# Altium schematic sheet rf.SchDoc
size A4; SheetNumber: 2; SheetTotal: 5; SPICEModelCacheDZKFQWXO: <root> / <DocumentId>DZKFQWXO</DocumentId> / <CacheFrame Number="0"> / <Model Name="gmk107b7474_aht" Kind="CKT"> / <Text>* GMK107B7474_AHT     SPICE MODEL  ( General Type ) / *-------------------------------------------------------------------------------------------------------- / * Model Generated by TAIYO YUDEN Corporation (http://www.ty-top.com) / * Version 1.0 / * TAIYO YUDEN Control No. 170508_121019 / * Copyright(c) 2012 TAIYO YUDEN CO.,LTD. All Rights Reserved. / *-------------------------------------------------------------------------------------------------------- / * / * Products Name : Multilayer Ceramic Capacitors / * / * Characteristics : / *     Capacitance : 0.47 uF , Rated Voltage : 35V , TCC : X7R / *     Case Size : 1.6 x 0.8 / 0.063 x 0.031 [mm/inch] , Thickness : 0.8 / 0.031 [mm/inch] / *     (Conditions: Temperature = 25 degC , DC Bias Current/Voltage = 0A / 0V) / * / * Frequency Range : 40Hz - 3GHz / * / * External Node Assignments : / * / *  1  o---| |---o  2 / * / *-------------------------------------------------------------------------------------------------------- / .SubCkt GMK107B7474_AHT 1 2 / **************************** / C0 1 110 0.35241u / Cm 1 101 0.045967u / C1 101 102 0.1128u / Rc1 101 102 7.0157k / C2 102 103 0.052259u / Rc2 102 103 650.62 / C3 103 110 0.038908u / Rc3 103 110 33.924 / C2m 1 301 0.059177u / C21 301 302 0.20596u / Rc21 301 302 18.494k / C22 302 303 0.3392u / Rc22 302 303 11.168k / C23 303 304 0.29488u / Rc23 303 304 12.333k / C24 304 305 0.15174u / Rc24 304 305 1.1874k / C25 305 306 0.15169u / Rc25 305 306 1.0968k / C26 306 307 0.081575u / Rc26 306 307 73.58 / C27 307 308 0.067021u / Rc27 307 308 74.754 / C28 308 309 0.057362u / Rc28 308 309 86.716 / C29 309 110 3917.4p / Rc29 309 110 14.273 / Rp0 1 110 1.06382978723404G / L0 110 120 0.25665n / Lm 120 130 0.18492n / L1 120 121 0.15921n / RL1 121 130 0.10518 / L2 120 122 1.1975n / RL2 122 130 0.76936 / L3 120 123 2.5752n / RL3 123 130 1.6537 / CR 120 124 0.034572u / LR 124 125 0.3441n / RR 125 130 93.45m / CL 130 140 1.8662p / LL 130 140 0.25845n / RL 130 140 37.948 / Rs 140 2 10.204m / **************************** / .ends GMK107B7474_AHT</Text> / </Model> / </CacheFrame> / </root>
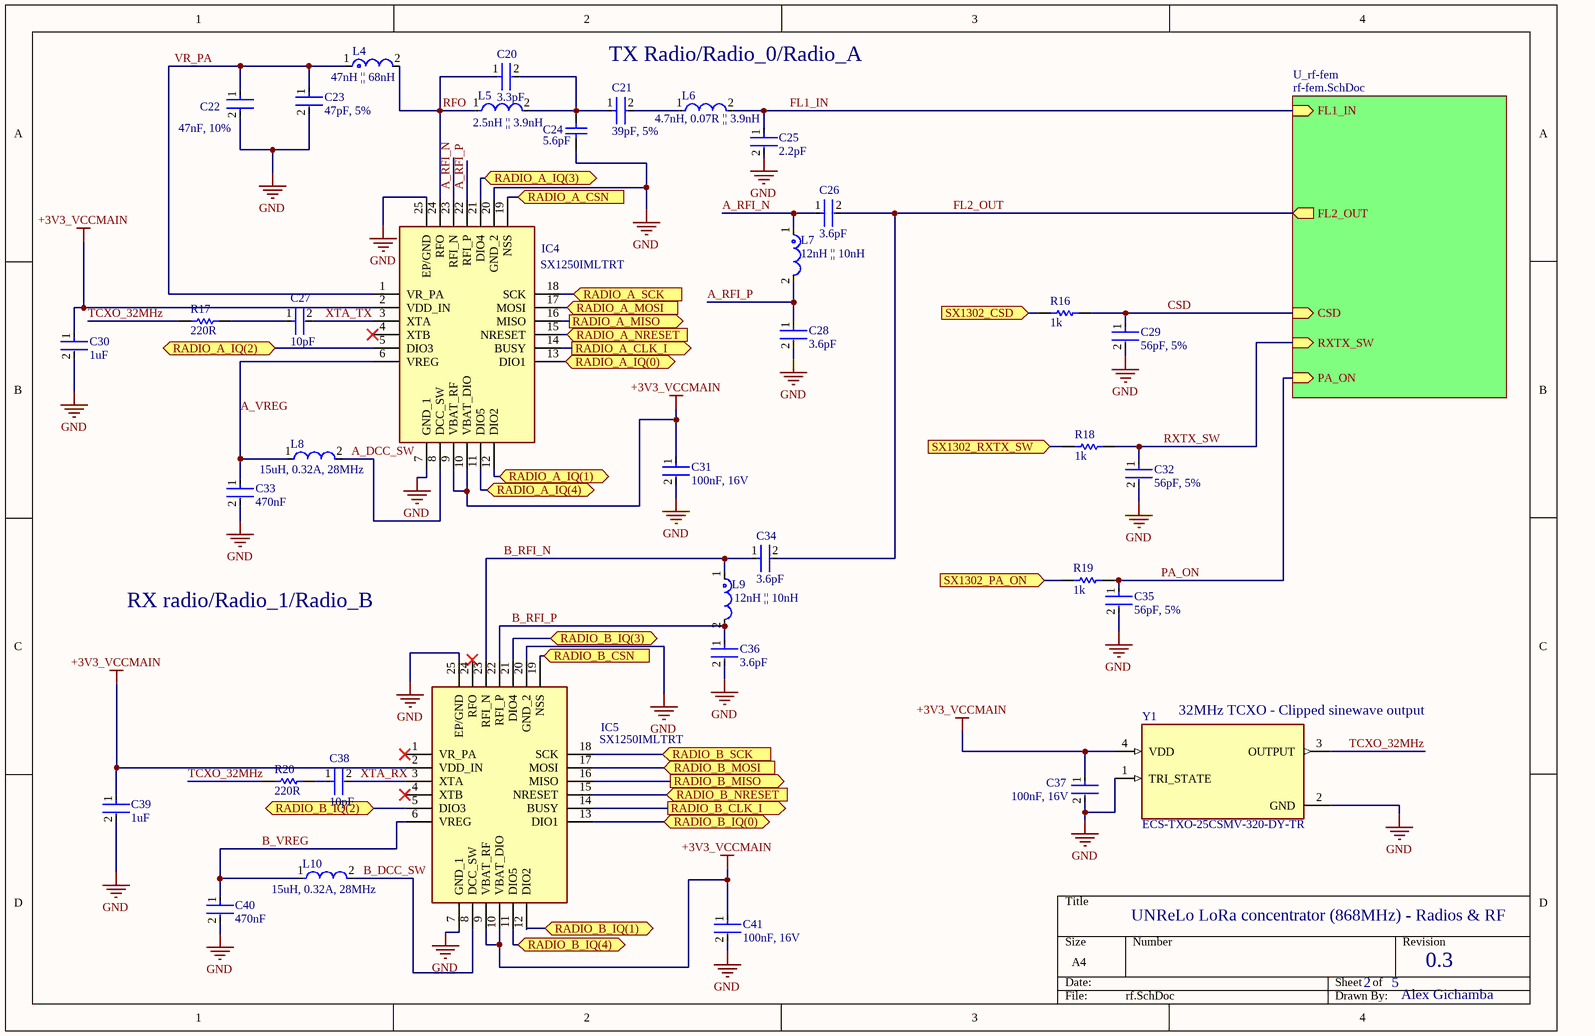
[diagram p0: rf.SchDoc]

## Parts
C20  3.3pF  [FP-GQM187-0_15-MFG]
C21  39pF, 5%  [FP-CL10-IPC_B]
C22  47nF, 10%  [FP-CL10-IPC_A]
C23  47pF, 5%  [FP-0603-L_1_6_0_15-W_0_81-MFG]
C24  5.6pF  [CAPC1608X90X35ML10T15]
C25  2.2pF  [FP-CL764-IPC_C]
C26  3.6pF  [FP-GJM155-0_05-IPC_C]
C27  10pF  [FP-CL10-IPC_A]
C28  3.6pF  [FP-GJM155-0_05-IPC_C]
C29  56pF, 5%  [FP-GCM188-0_1-IPC_A]
C30  1uF  [FP-CL21-IPC_A]
C31  100nF, 16V  [FP-CC0603-DA-MFG]
C32  56pF, 5%  [FP-GCM188-0_1-IPC_A]
C33  470nF  [FP-0603-L_1_6_0_1-W_0_8_0-IPC_A]
C34  3.6pF  [FP-GJM155-0_05-IPC_C]
C35  56pF, 5%  [FP-GCM188-0_1-IPC_A]
C36  3.6pF  [FP-GJM155-0_05-IPC_C]
C37  100nF, 16V  [FP-CC0603-DA-MFG]
C38  10pF  [FP-CL10-IPC_A]
C39  1uF  [FP-CL21-IPC_A]
C40  470nF  [FP-0603-L_1_6_0_1-W_0_8_0-IPC_A]
C41  100nF, 16V  [FP-CC0603-DA-MFG]
IC4  SX1250IMLTRT  [QFN50P400X400X100-25N-D]
IC5  SX1250IMLTRT  [QFN50P400X400X100-25N-D]
L4  47nH || 68nH  [FP-LQG18HH_00-MFG]
L5  2.5nH || 3.9nH  [FP-LQW15AN_00-W0_6-0_1-MFG]
L6  4.7nH, 0.07R || 3.9nH  [FP-LQW15AN_00-W0_6-0_1-MFG]
L7  12nH || 10nH  [FP-LQG15HH_02-IPC_A]
L8  15uH, 0.32A, 28MHz  [FP-CB2012-MFG]
L9  12nH || 10nH  [FP-LQG15HH_02-IPC_A]
L10  15uH, 0.32A, 28MHz  [FP-CB2012-MFG]
R16  1k  [RESC2013X70X40ML20T20]
R17  220R  [RESC1608X55X30LL15T15]
R18  1k  [RESC2013X70X40ML20T20]
R19  1k  [RESC2013X70X40ML20T20]
R20  220R  [RESC1608X55X30LL15T15]
Y1  ECS-TXO-25CSMV-320-DY-TR  [OSC_ECS-TXO-25CSMV-320-DY-TR]

## Sub-sheets
U_rf-fem = rf-fem.SchDoc: CSD (in), PA_ON (in), RXTX_SW (in), FL1_IN (in), FL2_OUT (out)

## Ports
RADIO_A_CLK_I (out), RADIO_A_CSN (in), RADIO_A_IQ(0) (bidir), RADIO_A_IQ(1) (bidir), RADIO_A_IQ(2) (bidir), RADIO_A_IQ(3) (bidir), RADIO_A_IQ(4) (bidir), RADIO_A_MISO (out), RADIO_A_MOSI (in), RADIO_A_NRESET (in), RADIO_A_SCK (in), RADIO_B_CLK_I (out), RADIO_B_CSN (in), RADIO_B_IQ(0) (bidir), RADIO_B_IQ(1) (bidir), RADIO_B_IQ(2) (bidir), RADIO_B_IQ(3) (bidir), RADIO_B_IQ(4) (bidir), RADIO_B_MISO (out), RADIO_B_MOSI (in), RADIO_B_NRESET (in), RADIO_B_SCK (in), SX1302_CSD (in), SX1302_PA_ON (in), SX1302_RXTX_SW (in)

## Nets
+3V3_VCCMAIN: C30.1 C31.1 C37.1 C39.1 C41.1 IC4.2(VDD_IN) IC4.9(VBAT_RF) IC4.10(VBAT_DIO) IC5.2(VDD_IN) IC5.9(VBAT_RF) IC5.10(VBAT_DIO) Y1.4(VDD)
GND: C22.2 C23.2 C24.1 C25.2 C28.2 C29.2 C30.2 C31.2 C32.2 C33.2 C35.2 C36.2 C37.2 C39.2 C40.2 C41.2 IC4.7(GND_1) IC4.20(GND_2) IC4.25(EP/GND) IC5.7(GND_1) IC5.20(GND_2) IC5.25(EP/GND) Y1.1(TRI_STATE) Y1.2(GND)
A_DCC_SW: IC4.8(DCC_SW) L8.2
A_RFI_N: C26.1 IC4.23(RFI_N) L7.1
A_RFI_P: C28.1 IC4.22(RFI_P) L7.2
A_VREG: C33.1 IC4.6(VREG) L8.1
B_DCC_SW: IC5.8(DCC_SW) L10.2
B_RFI_N: C34.1 IC5.23(RFI_N) L9.1
B_RFI_P: C36.1 IC5.22(RFI_P) L9.2
B_VREG: C40.1 IC5.6(VREG) L10.1
CSD: C29.1 R16.2 ; sheet U_rf-fem/CSD
FL1_IN: C25.1 L6.2 ; sheet U_rf-fem/FL1_IN
FL2_OUT: C26.2 C34.2 ; sheet U_rf-fem/FL2_OUT
PA_ON: C35.1 R19.2 ; sheet U_rf-fem/PA_ON
RADIO_A_CLK_I: IC4.14(BUSY) ; port RADIO_A_CLK_I
RADIO_A_CSN: IC4.19(NSS) ; port RADIO_A_CSN
RADIO_A_IQ(0): IC4.13(DIO1) ; port RADIO_A_IQ(0)
RADIO_A_IQ(1): IC4.12(DIO2) ; port RADIO_A_IQ(1)
RADIO_A_IQ(2): IC4.5(DIO3) ; port RADIO_A_IQ(2)
RADIO_A_IQ(3): IC4.21(DIO4) ; port RADIO_A_IQ(3)
RADIO_A_IQ(4): IC4.11(DIO5) ; port RADIO_A_IQ(4)
RADIO_A_MISO: IC4.16(MISO) ; port RADIO_A_MISO
RADIO_A_MOSI: IC4.17(MOSI) ; port RADIO_A_MOSI
RADIO_A_NRESET: IC4.15(NRESET) ; port RADIO_A_NRESET
RADIO_A_SCK: IC4.18(SCK) ; port RADIO_A_SCK
RADIO_B_CLK_I: IC5.14(BUSY) ; port RADIO_B_CLK_I
RADIO_B_CSN: IC5.19(NSS) ; port RADIO_B_CSN
RADIO_B_IQ(0): IC5.13(DIO1) ; port RADIO_B_IQ(0)
RADIO_B_IQ(1): IC5.12(DIO2) ; port RADIO_B_IQ(1)
RADIO_B_IQ(2): IC5.5(DIO3) ; port RADIO_B_IQ(2)
RADIO_B_IQ(3): IC5.21(DIO4) ; port RADIO_B_IQ(3)
RADIO_B_IQ(4): IC5.11(DIO5) ; port RADIO_B_IQ(4)
RADIO_B_MISO: IC5.16(MISO) ; port RADIO_B_MISO
RADIO_B_MOSI: IC5.17(MOSI) ; port RADIO_B_MOSI
RADIO_B_NRESET: IC5.15(NRESET) ; port RADIO_B_NRESET
RADIO_B_SCK: IC5.18(SCK) ; port RADIO_B_SCK
RFO: C20.1 IC4.24(RFO) L4.2 L5.1
RXTX_SW: C32.1 R18.2 ; sheet U_rf-fem/RXTX_SW
SX1302_CSD: R16.1 ; port SX1302_CSD
SX1302_PA_ON: R19.1 ; port SX1302_PA_ON
SX1302_RXTX_SW: R18.1 ; port SX1302_RXTX_SW
TCXO_32MHz: R17.1 R20.1 Y1.3(OUTPUT)
VR_PA: C22.1 C23.1 IC4.1(VR_PA) L4.1
XTA_RX: C38.2 IC5.3(XTA)
XTA_TX: C27.2 IC4.3(XTA)
NetC20_2: C20.2 C21.1 C24.2 L5.2
NetC21_2: C21.2 L6.1
NetC27_1: C27.1 R17.2
NetC38_1: C38.1 R20.2

Not connected (* = marked no-connect by the designer): IC4 4(XTB)*; IC5 1(VR_PA)* 4(XTB)* 24(RFO)*

## Notes on the sheet
- TX Radio/Radio_0/Radio_A
- RX radio/Radio_1/Radio_B
- (near Y1) 32MHz TCXO - Clipped sinewave output
- UNReLo LoRa concentrator (868MHz) - Radios & RF
- 2
- 5
- 0.3
- Alex Gichamba

## Library data of the parts
C20 = CMP-2006-03899-2: Ceramic Capacitor 3.3pF ±0.1pF 250VDC C0G 0603 Paper T/R; Voltage Rating: 250V; Max Operating Temperature: 125°C; Case Code (Imperial): 0603; Depth: 0.8mm; Width: 0.8mm; Package Quantity: 4000; Height: 0.7mm; Case Code (Metric): 1608; Case/Package: 0603; Radiation Hardening: No; Min Operating Temperature: -55°C; Thickness: 0.031inch; Dielectric: C0G; Length: 1.6mm; Mount: Surface Mount; Packaging: Tape and Reel; Termination: SMD/SMT; Voltage Rating (DC): 250V; Capacitance: 3.3pF
C21 = CMP-13271-000028-1: Cap Ceramic 39pF 50V C0G ±5% Pad SMD 0603 +125°C T/R; Temperature Coefficient: 300ppm/°C; Depth: 0.8mm; Contact Plating: Tin; Tolerance: 5%; Thickness: 0.035inch; Mount: Surface Mount; Packaging: Tape and Reel; Min Operating Temperature: -55°C; Package Quantity: 1; Height: 0.8mm; Voltage: 50V; Dielectric: C0G; Radiation Hardening: No; Case Code (Metric): 1608; Max Operating Temperature: 125°C; Case/Package: 0603; Length: 1.6mm; Width: 0.031inch; Material: Ceramic; Capacitance: 39pF; Voltage Rating: 50V; Case Code (Imperial): 0603
C22 = CMP-13271-001056-1: Cap Ceramic 47nF 50V X7R ±10% Pad SMD 0603 +125°C T/R; Dielectric: Y5V; Packaging: Tape and Reel; Material: Ceramic; Max Operating Temperature: 125°C; Case/Package: 0603; Voltage Rating: 50V; Tolerance: 10%; Voltage: 50V; Height: 0.8mm; Capacitance: 47nF; Mount: Surface Mount; Min Operating Temperature: -55°C; Package Quantity: 4000; Length: 1.6mm; Depth: 0.8mm; Lead Free: Lead Free; Case Code (Metric): 1608; Width: 0.031inch; Thickness: 0.035inch; Case Code (Imperial): 0603; Radiation Hardening: No; Voltage Rating (DC): 50V; Contact Plating: Tin
C23 = CMP-2006-04316-2: General Purpose Ceramic Capacitor, 0603, 47pF, 5%, NP0, 30ppm/°C, 50V; Dielectric: C0G; Number of Pins: 2; REACH SVHC: No SVHC; Height: 0.9mm; Max Operating Temperature: 125°C; Voltage Rating: 50V; Thickness: 0.035inch; Temperature Coefficient: 30ppm/°C; Tolerance: 5%; Termination: SMD/SMT; Length: 1.6mm; Case/Package: 0603; Depth: 0.81mm; Min Operating Temperature: -55°C; Capacitance: 47pF; Contact Plating: Tin; Voltage Rating (DC): 50V; Case Code (Metric): 1608; Packaging: Tape and Reel; RoHS Compliant: Yes; Radiation Hardening: No; Width: 0.032inch; Voltage: 50V; Mount: Surface Mount; Case Code (Imperial): 0603; Package Quantity: 1; Lead Free: Lead Free
C24 = CMP-2006-02546-1: Manufacturer: Murata; Part Number: GRM1885C1H5R6BA01D
C25 = CMP-13271-003461-1: Cap Ceramic 2.2pF 50V C0G ±0.1pF SMD 0402 +125°C Paper T/R; Temperature Coefficient: 300ppm/°C; Width: 0.02inch; Packaging: Tape and Reel; Length: 1mm; Package Quantity: 1; Depth: 0.5mm; Radiation Hardening: No; Dielectric: C0G; Case/Package: 0402; Capacitance: 2.2pF; Lead Free: Lead Free; Min Operating Temperature: -55°C; Case Code (Imperial): 0402; Max Operating Temperature: 125°C; Case Code (Metric): 1005; Voltage Rating (DC): 50V; Thickness: 0.022inch; Mount: Surface Mount; Voltage: 50V; Height: 0.5mm; Voltage Rating: 50V
C26 C28 C34 C36 = CMP-2008-03849-2: Multi-Layer Ceramic Capacitor 3.6pF C0G  ±0.1pF 0402 Paper T/R; Voltage Rating (DC): 50V; Height: 0.5mm; Dielectric: C0G; Case Code (Metric): 1005; Mount: Surface Mount; Radiation Hardening: No; Length: 1mm; Case/Package: 0402; Packaging: Tape and Reel; Max Operating Temperature: 125°C; Lead Free: Lead Free; Min Operating Temperature: -55°C; Voltage Rating: 50V; Package Quantity: 10000; Termination: SMD/SMT; Depth: 0.5mm; Width: 0.5mm; Thickness: 0.022inch; Case Code (Imperial): 0402; Capacitance: 3.6pF
C27 C38 = CMP-13271-001725-1: Cap Ceramic 10pF 50V C0G ±5% Pad SMD 0603 +125°C T/R; Temperature Coefficient: 300ppm/°C; Packaging: Tape and Reel; Voltage: 50V; Lead Free: Lead Free; Voltage Rating: 50V; Dielectric: C0G; Package Quantity: 10000; Depth: 0.8mm; Mount: Surface Mount; Capacitance: 10pF; Thickness: 0.035inch; Tolerance: 5%; Length: 1.6mm; Voltage Rating (DC): 50V; Width: 0.031inch; Radiation Hardening: No; Max Operating Temperature: 125°C; Case/Package: 0603; Height: 0.8mm; Min Operating Temperature: -55°C
C29 C32 C35 = CMP-06035-013037-1: Ceramic Capacitor for Automotive 56pF  ±5% 100VDC C0G 0603 Paper T/R; Voltage Rating: 100V; Max Operating Temperature: 125°C; Packaging: Tape and Reel; Depth: 0.8mm; Mount: Surface Mount; Case Code (Imperial): 0603; Length: 1.6mm; Case Code (Metric): 1608; Capacitance: 56pF; Case/Package: 0603; Width: 0.8mm; Termination: SMD/SMT; Dielectric: C0G; Radiation Hardening: No; Tolerance: 5%; Package Quantity: 4000; Thickness: 0.035inch; Ratings: AEC-Q200; Min Operating Temperature: -25°C; Height: 0.8mm; Voltage Rating (DC): 100V
C30 C39 = CMP-13271-003098-1: CL21 Series 0805 1uF 16V ±10% Tolerance X7R Multilayer Ceramic Chip Capacitor; Case Code (Metric): 2012; Width: 0.049inch; Thickness: 0.053inch; Voltage Rating: 16V; Max Operating Temperature: 125°C; Case Code (Imperial): 0805; Height: 1.25mm; Length: 2mm; Case/Package: 0805; Lead Free: Lead Free; Mount: Surface Mount; Capacitance: 1uF; Tolerance: 10%; Voltage Rating (DC): 16V; Min Operating Temperature: -55°C; Contact Plating: Tin; Depth: 1.25mm; Packaging: Tape and Reel; Package Quantity: 1; Voltage: 16V; Dielectric: X7R; Radiation Hardening: No
C31 C37 C41 = CMP-2100-03601-2: CAP CER 0.1UF 50V X7R 0603; Manufacturer: YAGEO; Manufacturer Part Number: CC0603KRX7R9BB104; Material: Ceramic; Temperature Coefficient: 15%; Tolerance: 0.1; Height: 0.9mm; Voltage: 50 V; ComponentLink2Description: Datasheet; Device Class L2: Capacitors; Temperature Range High: +125°C; Category: Cap; Capacitance: 100 nF; Footprint Url: http://www.yageo.com/exep/pages/download/literatures/UPY-C_GEN_24.pdf; ComponentLink2URL: http://www.yageo.com/documents/recent/UPY-GPHC_X7R_6.3V-to-50V_18.pdf; Package: CC0603-DA; Temperature: -55°C to +125°C; Voltage Rating: 50 V; Temperature Characteristic: X7R; Device Class L1: Passive Components; Temperature Range Low: -55°C; RoHS: TRUE; Automotive: No; Value: 100 nF; Device Class L3: Ceramic Capacitors; Octopart: https://octopart.com/cc0603krx7r9bb104-yageo-42244635; Mouser Description: Multilayer Ceramic Capacitor, CC Series, 0.1 - F, - 10%, X7R, 50 V, 0603 [1608 Metric]; Lead Free: Yes; Digikey Description: CAP CER 0.1UF 50V X7R 0603
C33 C40 = CMP-14477-002264-2: None; Dielectric: X7R; Voltage Rating (DC): 35V; Tolerance: 10%; Min Operating Temperature: -55°C; Package Quantity: 1; Termination: SMD/SMT; Case Code (Imperial): 0603; Case Code (Metric): 1608; Thickness: 0.035inch; Halogen Free: Halogen Free; RoHS Compliant: Yes; Ratings: AEC-Q200; Height: 0.8mm; Case/Package: 0603; Packaging: Tape and Reel; Capacitance: 470nF; Voltage Rating: 35V; Lead Free: Lead Free; Width: 0.031inch; Mount: Surface Mount; Length: 0.063inch; Max Operating Temperature: 125°C
IC4 IC5 = SX1250IMLTRT: Integrated Circuit; Manufacturer_Name: SEMTECH; Datasheet Link: https://componentsearchengine.com/Datasheets/1/SX1250IMLTRT.pdf; Height: 1mm; Manufacturer_Part_Number: SX1250IMLTRT; Mouser Part Number: 947-SX1250IMLTRT; Mouser Price/Stock: https://www.mouser.co.uk/ProductDetail/Semtech/SX1250IMLTRT?qs=bZr6mbWTK5l3tz86ZAy1ig%3D%3D; Arrow Part Number: SX1250IMLTRT; Arrow Price/Stock: https://www.arrow.com/en/products/sx1250imltrt/semtech?region=nac
L4 = CMP-06042-006563-1: Multilayer type RF Inductor 68nH ±5% 0.8Ω 400mA 0603; Core Material: Air; DC Current: 300mA; Q Factor: 12; Test Frequency: 100MHz; DC Resistance (DCR): 800mR; Shielding: Unshielded; Self Resonant Frequency: 1GHz; Termination: SMD/SMT; Mount: Surface Mount; Case Code (Imperial): 0603; Height: 0.031inch; Tolerance: 5%; Inductance Tolerance: 5%; Package Quantity: 4000; Width: 0.8mm; Length: 0.063inch; Inductance: 68nH; Depth: 0.95mm; Case Code (Metric): 1608; Max DC Current: 300mA; Case/Package: 0603; Military Standard: Not; Min Operating Temperature: -55°C; REACH SVHC: No SVHC; Number of Pins: 2; Max Operating Temperature: 85°C; Lead Free: Lead Free; Current Rating: 300mA; Radiation Hardening: No; Packaging: Tape and Reel
L5 L6 = CMP-06042-009351-1: Wire Wound RF Inductor 4.7nH ±0.1nH 750mA 0.07Ω 0402 (1005); Self Resonant Frequency: 8GHz; Tolerance: 2%; Core Material: Air; Test Frequency: 100MHz; DC Resistance (DCR): 70mR; Q Factor: 25; Current: 140mA; Shielding: Unshielded; Case Code (Metric): 1005; Packaging: Tape and Reel; Max DC Current: 750mA; Max Operating Temperature: 125°C; Inductance: 4.7nH; Height: 0.5mm; Length: 1mm; DC Current: 750mA; Case/Package: 0402; Termination: SMD/SMT; Depth: 0.7mm; Radiation Hardening: No; Military Standard: Not; Current Rating: 750mA; Mount: Surface Mount; Package Quantity: 10000; Min Operating Temperature: -55°C; Lead Free: Lead Free; Weight: 2.8E-05oz; REACH SVHC: No SVHC; Width: 0.02inch; Case Code (Imperial): 0402
L7 L9 = CMP-06042-014117-1: Multilayer type RF Inductor 10nH ±5% 0.26Ω 500mA 0402; DC Resistance (DCR): 260mR; DC Current: 300mA; Shielding: Unshielded; Q Factor: 8; Test Frequency: 100MHz; Self Resonant Frequency: 3.4GHz; Core Material: Air; Width: 0.5mm; Radiation Hardening: No; Packaging: Tape and Reel; Lead Free: Lead Free; Military Standard: Not; Case/Package: 0402; Current Rating: 300mA; Case Code (Metric): 1005; Length: 0.039inch; Termination: SMD/SMT; Max DC Current: 300mA; Max Operating Temperature: 125°C; Mount: Surface Mount; Height - Seated (Max): 0.022inch; Package Quantity: 10000; Height: 0.5mm; Inductance: 10nH; Tolerance: 5%; Case Code (Imperial): 0402; Depth: 0.55mm; Min Operating Temperature: -55°C
L8 L10 = CMP-14484-000337-1: SMD Inductors 15uH ±10% 0.32A 1.69Ω 0805; DC Resistance (DCR): 1.69R; Max DC Current: 170mA; Test Frequency: 2.52MHz; Shielding: Unshielded; Current Rating: 320mA; Core Material: Ferrite; Mount: Surface Mount; Number of Pins: 2; Depth: 1.45mm; Lead Free: Lead Free; Max Operating Temperature: 105°C; Width: 0.049inch; Packaging: Tape and Reel; Package Quantity: 3000; Height - Seated (Max): 0.057inch; Inductance: 15uH; Halogen Free: Halogen Free; Height: 0.9mm; Termination: SMD/SMT; Tolerance: 10%; RoHS Compliant: Yes; Case Code (Imperial): 0805; Series: CB; Min Operating Temperature: -40°C; Resistor Type: Wirewound; Self Resonant Frequency: 28MHz; Radiation Hardening: No; Case Code (Metric): 2012; Length: 0.079inch; Saturation Current: 170mA; Case/Package: 0805
R16 R18 R19 = CMP-2001-04375-5: Chip Resistor, 1 KOhm, +/- 1%, 0.125 W, -55 to 155 degC, 0805 (2012 Metric), RoHS, Tape and Reel; Manufacturer: Panasonic; Voltage Rating: 150 V; ComponentLink1URL: http://www.panasonic.com/; ComponentLink2Description: Datasheet; REACH SVHC: Yes; ComponentLink1Description: Manufacturer URL; Length: 2 mm; Height: 0.6 mm; Package Quantity: 1; PackageDescription: 2-Pin Surface Mount Device, Body 2 x 1.25 mm; Packaging: Cut Tape; PackageReference: 0805; Max Operating Temperature: 155 degC; Mounting Technology: Surface Mount; ComponentLink2URL: http://industrial.panasonic.com/cdbs/www-data/pdf/RDA0000/AOA0000C86.pdf; DatasheetVersion: 04/2015; Min Operating Temperature: -55 degC; RoHSCompliant: true; Mount: Surface Mount
R17 R20 = CMP-2000-00335-2: Chip Resistor, 220 Ohm, +/- 1%, 0.1 W, -55 to 155 degC, 0603 (1608 Metric), RoHS, Tape and Reel; Voltage Rating: 50 V; Resistance: 22 Ohm; Power Rating: 100 mW; Case\Package: 0603; ComponentLink2Description: Datasheet; PackageDescription: 2-Pin Surface Mount Device, Body 1.6 x 0.85 mm; PackageReference: 0603; ComponentLink1Description: Manufacturer URL; ComponentLink2URL: http://industrial.panasonic.com/cdbs/www-data/pdf/RDA0000/AOA0000C86.pdf; Height: 0.45 mm; Mount: Surface Mount; Case Code (Metric): 1608; Pins: 2; Width: 0.8 mm; Length: 1.6 mm; Package Quantity: 5000; Tolerance: 1%; ComponentLink1URL: http://www.panasonic.com/; Max Operating Temperature: 155 degC; Min Operating Temperature: -55 degC; RoHSCompliant: true; Packaging: Tape and Reel; Case Code (Imperial): 0603; DatasheetVersion: Apr-15; REACH SVHC: No SVHC; Voltage Rating (DC): 50 V
Y1 = ECS-TXO-25CSMV-320-DY-TR: Package: None; Price: None; Value: *; MP: ECS-TXO-25CSMV-320-DY-TR; Availability: Unavailable